# Altium project funny_car.PrjPCB
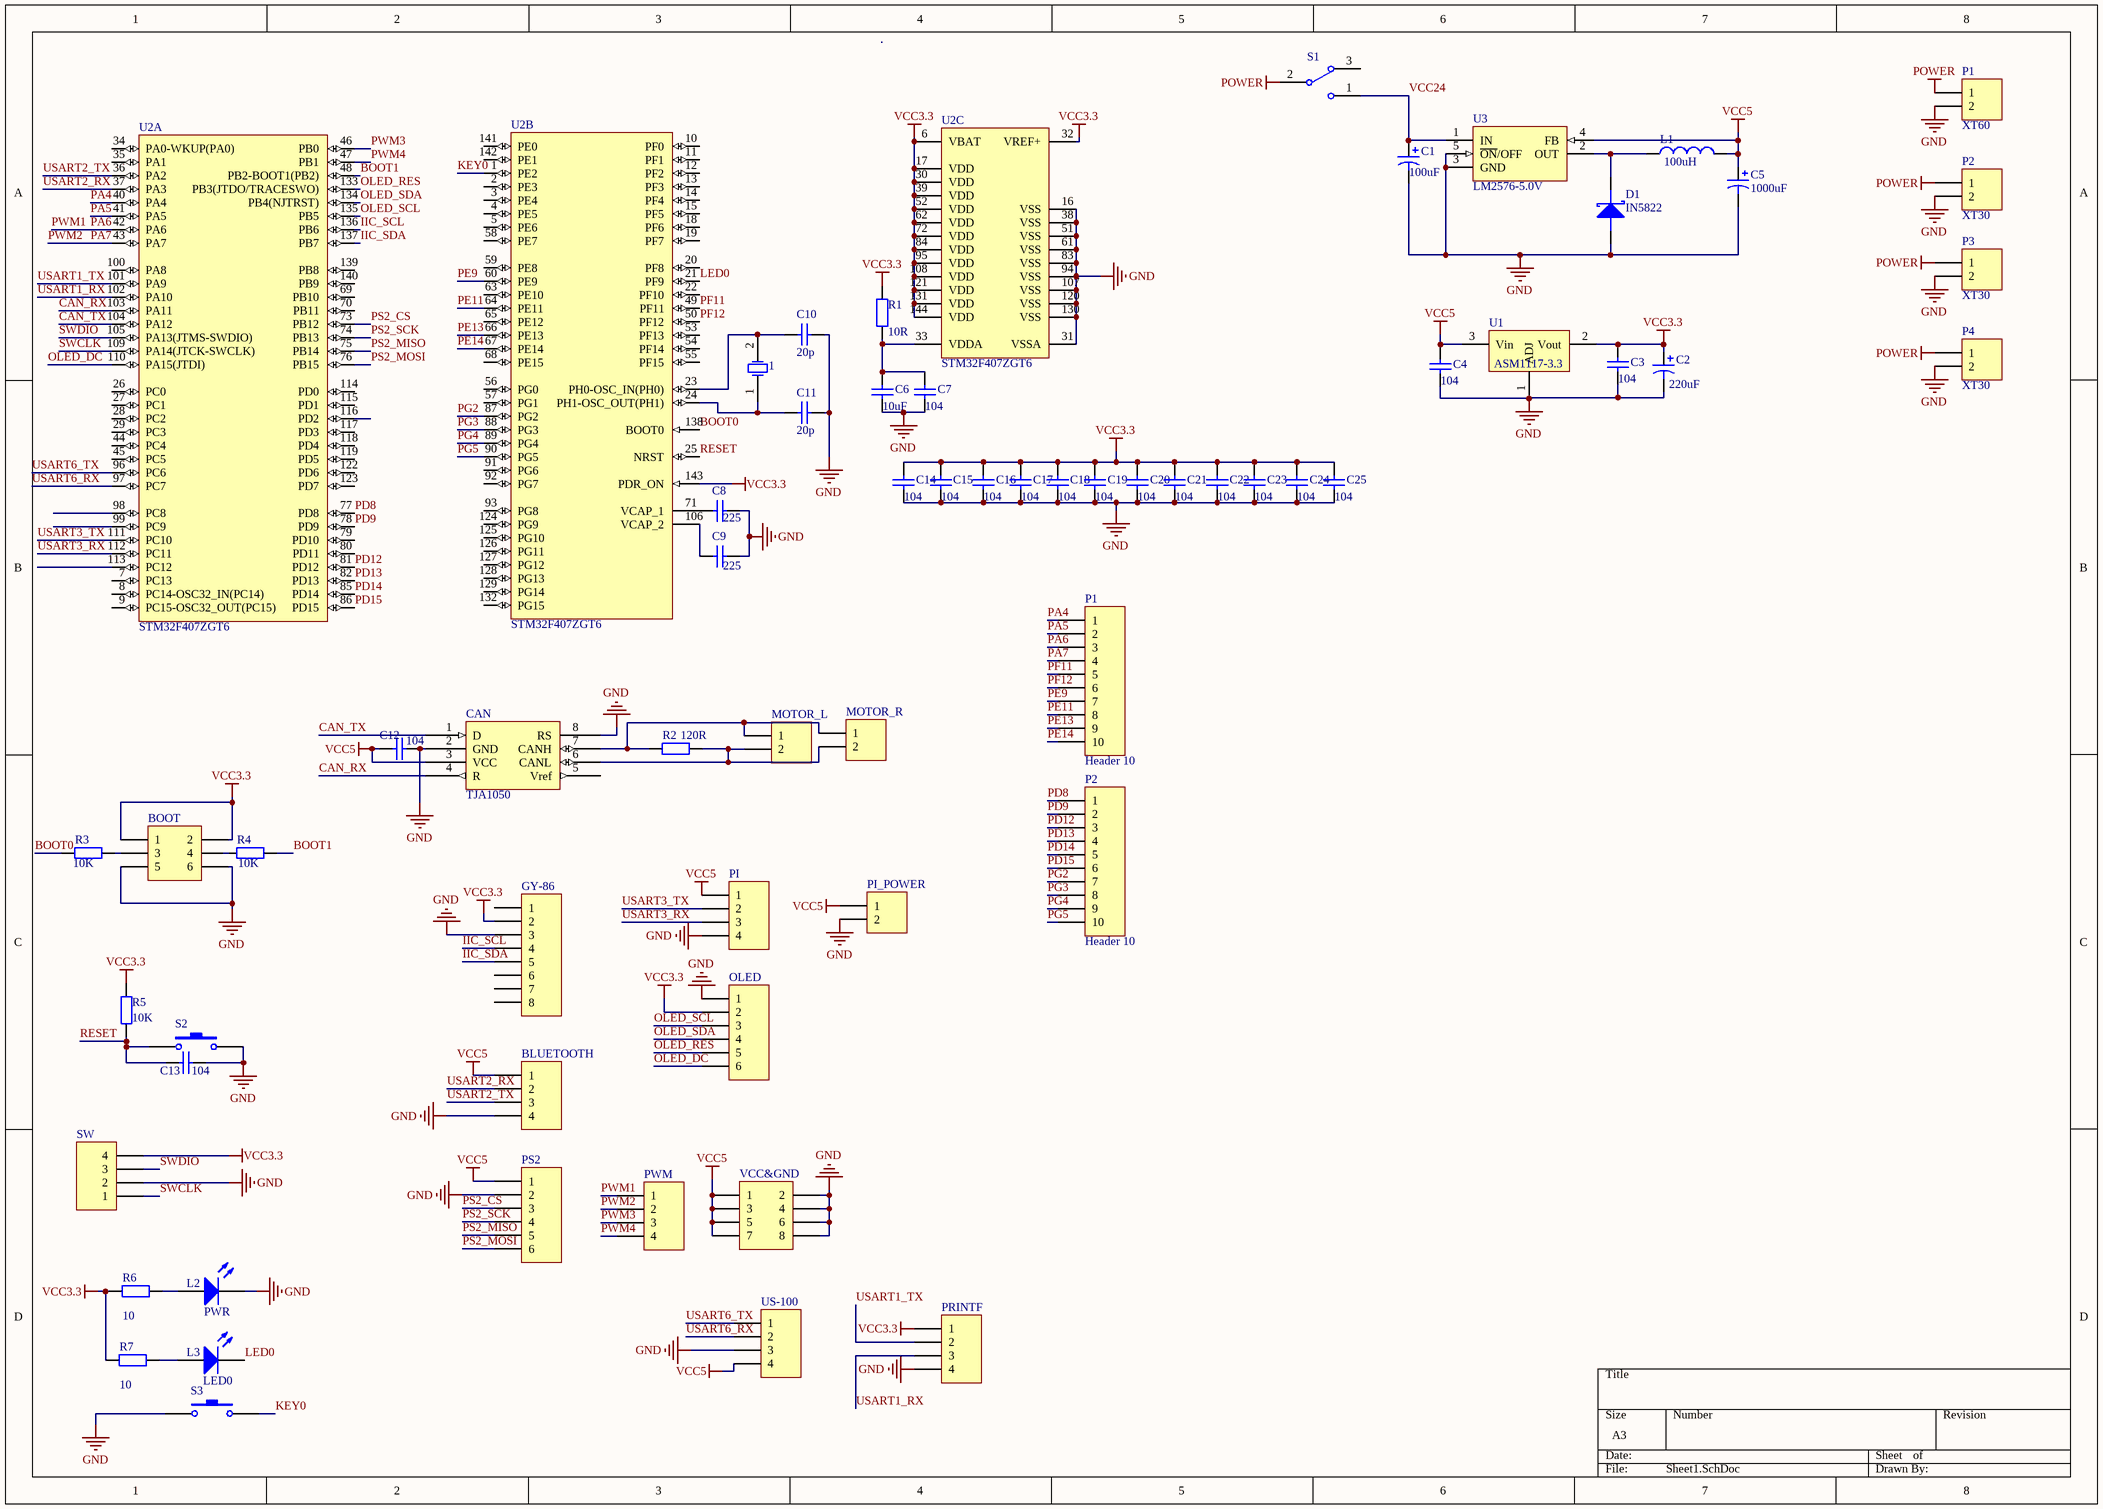
[diagram p0: Sheet1.SchDoc]
1 sheet, 64 parts. Net scope: global (net labels, ports and power ports of the same name join across sheets).
Board file: PCB1.PcbDoc

## Sheet Sheet1.SchDoc
size A3

### Parts
(Parts that share a designator on the sheet are numbered #1, #2 ... from top to bottom, then left to right.)
1  XTAL  [XTAL-QC49/SMD]  (value not drawn)
BLUETOOTH  Header 4  [ZH1.5-WS-4P]  (value not drawn)
BOOT  Header 3X2  [HDR2X3]  (value not drawn)
C1  value 100uF  [C7343]  (hidden comment: Cap Pol1)
C2  value 220uF  [C6032]
C3  value 104  [0805C]
C4  value 104  [0805C]
C5  value 1000uF  [SMD-EC-F10]  (hidden comment: Cap Pol1)
C6  value 10uF  [0805C]
C7  value 104  [0805C]
C8  value 225  [0805C]
C9  value 225  [0805C]
C10  value 20p  [0805C]  (hidden comment: Cap)
C11  value 20p  [0805C]  (hidden comment: Cap)
C12  value 104  [0805C]
C13  value 104  [0805C]
C14  value 104  [0805C]
C15  value 104  [0805C]
C16  value 104  [0805C]
C17  value 104  [0805C]
C18  value 104  [0805C]
C19  value 104  [0805C]
C20  value 104  [0805C]
C21  value 104  [0805C]
C22  value 104  [0805C]
C23  value 104  [0805C]
C24  value 104  [0805C]
C25  value 104  [0805C]
CAN  TJA1050  [SOP8_N]
D1  IN5822  [SMB]
GY-86  Header 8  [HDR1X8]  (value not drawn)
L1  value 100uH  [CD54NP]  (hidden comment: Inductor)
L2  PWR  [LED0805]
L3  LED0  [LED0805]
MOTOR_L  XH2.54*2  [ZH1.5-WS-2P]  (value not drawn)
MOTOR_R  XH2.54*2  [ZH1.5-WS-2P]  (value not drawn)
OLED  Header 6  [HDR1X6]  (value not drawn)
P1#1  XT60  [XT60PW]
P1#2  Header 10  [ZH1.5-WS-10P]
P2#1  XT30  [XT30PW]
P2#2  Header 10  [ZH1.5-WS-10P]
P3  XT30  [XT30PW]
P4  XT30  [2PIN-5.08B]
PI  Header 4  [ZH1.5-WS-4P]  (value not drawn)
PI_POWER  Header 2  [2PIN-5.08B]  (value not drawn)
PRINTF  Header 4  [ZH1.5-WS-4P]  (value not drawn)
PS2  Header 6  [ZH1.5-WS-6P]  (value not drawn)
PWM  Header 4  [HDR1X4]  (value not drawn)
R1  value 10R  [0805R]
R2  value 120R  [0805R]
R3  value 10K  [0805R]
R4  value 10K  [0805R]
R5  value 10K  [0805R]
R6  value 10  [0805R]
R7  value 10  [0805R]
S1  开关  [拨动开关]  (value not drawn)
S2  SW-PB  [TSW DIP-3*6*5]  (value not drawn)
S3  SW-PB  [TSW DIP-3*6*5]  (value not drawn)
SW  XH2.54*4  [ZH1.5-WS-4P]  (value not drawn)
U1  ASM1117-3.3  [SOT223]
U2  STM32F407ZGT6  [STM-LQFP144_N]  (parts A,B,C of 3)
U3  LM2576-5.0V  [TO263-5]
US-100  Header 4  [ZH1.5-WS-4P]  (value not drawn)
VCC&GND  Header 4X2  [HDR2X4]  (value not drawn)

### Nets
GND: BLUETOOTH.4 BOOT.5 BOOT.6 C1.2 C2.2 C3.1 C4.1 C5.2 C6.1 C7.1 C8.1 C9.2 C10.1 C11.1 C12.1 C13.1 C14.1 C15.1 C16.1 C17.1 C18.1 C19.1 C20.1 C21.1 C22.1 C23.1 C24.1 C25.1 CAN.2(GND) CAN.8(RS) D1.1 GY-86.3 L2.2(K) OLED.1 P1#1.2 P2#1.2 P3.2 P4.2 PI.4 PI_POWER.2 PRINTF.4 PS2.2 S2.2 S3.1 SW.2 U1.1(ADJ) U2.16(VSS) U2.31(VSSA) U2.38(VSS) U2.51(VSS) U2.61(VSS) U2.83(VSS) U2.94(VSS) U2.107(VSS) U2.120(VSS) U2.130(VSS) U3.3(GND) U3.5(~{ON}/OFF) US-100.3 VCC&GND.2 VCC&GND.4 VCC&GND.6 VCC&GND.8
POWER: P1#1.1 P2#1.1 P3.1 P4.1 S1.2
VCC3.3: BOOT.1 BOOT.2 C2.1 C3.2 C14.2 C15.2 C16.2 C17.2 C18.2 C19.2 C20.2 C21.2 C22.2 C23.2 C24.2 C25.2 GY-86.2 OLED.2 PRINTF.1 R1.1 R5.1 R6.1 R7.1 SW.4 U1.2(Vout) U2.6(VBAT) U2.17(VDD) U2.30(VDD) U2.32(VREF+) U2.39(VDD) U2.52(VDD) U2.62(VDD) U2.72(VDD) U2.84(VDD) U2.95(VDD) U2.108(VDD) U2.121(VDD) U2.131(VDD) U2.143(PDR_ON) U2.144(VDD)
VCC5: BLUETOOTH.1 C4.2 C5.1 C12.2 CAN.3(VCC) L1.2 PI.1 PI_POWER.1 PS2.1 U1.3(Vin) U3.4(FB) US-100.4 VCC&GND.1 VCC&GND.3 VCC&GND.5 VCC&GND.7
BOOT0: R3.1 U2.138(BOOT0)
BOOT1: R4.2 U2.48(PB2-BOOT1(PB2))
CAN_RX: CAN.4(R) U2.103(PA11)
CAN_TX: CAN.1(D) U2.104(PA12)
IIC_SCL: GY-86.4 U2.136(PB6)
IIC_SDA: GY-86.5 U2.137(PB7)
KEY0: S3.2 U2.1(PE2)
LED0: L3.2(K) U2.21(PF9)
OLED_DC: OLED.6 U2.110(PA15(JTDI))
OLED_RES: OLED.5 U2.133(PB3(JTDO/TRACESWO))
OLED_SCL: OLED.3 U2.135(PB5)
OLED_SDA: OLED.4 U2.134(PB4(NJTRST))
PA4: P1#2.1 U2.40(PA4)
PA5: P1#2.2 U2.41(PA5)
PA6: P1#2.3 PWM.1 U2.42(PA6)  [also labelled PWM1]
PA7: P1#2.4 PWM.2 U2.43(PA7)  [also labelled PWM2]
PD8: P2#2.1 U2.77(PD8)
PD9: P2#2.2 U2.78(PD9)
PD12: P2#2.3 U2.81(PD12)
PD13: P2#2.4 U2.82(PD13)
PD14: P2#2.5 U2.85(PD14)
PD15: P2#2.6 U2.86(PD15)
PE9: P1#2.7 U2.60(PE9)
PE11: P1#2.8 U2.64(PE11)
PE13: P1#2.9 U2.66(PE13)
PE14: P1#2.10 U2.67(PE14)
PF11: P1#2.5 U2.49(PF11)
PF12: P1#2.6 U2.50(PF12)
PG2: P2#2.7 U2.87(PG2)
PG3: P2#2.8 U2.88(PG3)
PG4: P2#2.9 U2.89(PG4)
PG5: P2#2.10 U2.90(PG5)
PS2_CS: PS2.3 U2.73(PB12)
PS2_MISO: PS2.5 U2.75(PB14)
PS2_MOSI: PS2.6 U2.76(PB15)
PS2_SCK: PS2.4 U2.74(PB13)
PWM3: PWM.3 U2.46(PB0)
PWM4: PWM.4 U2.47(PB1)
RESET: C13.2 R5.2 S2.1 U2.25(NRST)
SWCLK: SW.1 U2.109(PA14(JTCK-SWCLK))
SWDIO: SW.3 U2.105(PA13(JTMS-SWDIO))
USART1_RX: PRINTF.3 U2.102(PA10)
USART1_TX: PRINTF.2 U2.101(PA9)
USART2_RX: BLUETOOTH.2 U2.37(PA3)
USART2_TX: BLUETOOTH.3 U2.36(PA2)
USART3_RX: PI.3 U2.112(PC11)
USART3_TX: PI.2 U2.111(PC10)
USART6_RX: U2.97(PC7) US-100.2
USART6_TX: U2.96(PC6) US-100.1
VCC24: C1.1 S1.1 U3.1(IN)
Net1_1: 1.1(OSC1) C11.2 U2.24(PH1-OSC_OUT(PH1))
Net1_2: 1.2(OSC2) C10.2 U2.23(PH0-OSC_IN(PH0))
NetBOOT_3: BOOT.3 R3.2
NetBOOT_4: BOOT.4 R4.1
NetC6_2: C6.2 C7.2 R1.2 U2.33(VDDA)
NetC8_2: C8.2 U2.71(VCAP_1)
NetC9_1: C9.1 U2.106(VCAP_2)
NetCAN_6: CAN.6(CANL) MOTOR_L.2 MOTOR_R.2 R2.2
NetCAN_7: CAN.7(CANH) MOTOR_L.1 MOTOR_R.1 R2.1
NetD1_2: D1.2 L1.1 U3.2(OUT)
NetL2_1: L2.1(A) R6.2
NetL3_1: L3.1(A) R7.2

Not connected (* = marked no-connect by the designer): CAN 5(Vref); GY-86 1 6 7 8; S1 3; U2 2(PE3) 3(PE4) 4(PE5) 5(PE6) 7(PC13) 8(PC14-OSC32_IN(PC14)) 9(PC15-OSC32_OUT(PC15)) 10(PF0) 11(PF1) 12(PF2) 13(PF3) 14(PF4) 15(PF5) 18(PF6) 19(PF7) 20(PF8) 22(PF10) 26(PC0) 27(PC1) 28(PC2) 29(PC3) 34(PA0-WKUP(PA0)) 35(PA1) 44(PC4) 45(PC5) 53(PF13) 54(PF14) 55(PF15) 56(PG0) 57(PG1) 58(PE7) 59(PE8) 63(PE10) 65(PE12) 68(PE15) 69(PB10) 70(PB11) 79(PD10) 80(PD11) 91(PG6) 92(PG7) 93(PG8) 98(PC8) 99(PC9) 100(PA8) 113(PC12) 114(PD0) 115(PD1) 116(PD2) 117(PD3) 118(PD4) 119(PD5) 122(PD6) 123(PD7) 124(PG9) 125(PG10) 126(PG11) 127(PG12) 128(PG13) 129(PG14) 132(PG15) 139(PB8) 140(PB9) 141(PE0) 142(PE1)

### Library data of the parts
1 = XTAL: Crystal Oscillator; Published: 8-Jun-2000; LatestRevisionDate: 17-Jul-2002; LatestRevisionNote: Re-released for DXP Platform.; PackageReference: R38; Publisher: Altium Limited; PackageDescription: Crystal, Thru-Hole; 2 Leads; Body 3.1 x 8.2 mm (Dia.xH)
BLUETOOTH PI PRINTF PWM SW US-100 = Header 4: Header, 4-Pin; LatestRevisionDate: 17-Jul-2002; LatestRevisionNote: Re-released for DXP Platform.; Publisher: Altium Limited
BOOT = Header 3X2: Header, 3-Pin, Dual row; LatestRevisionDate: 17-Jul-2002; LatestRevisionNote: Re-released for DXP Platform.; Publisher: Altium Limited
C1 C2 C5 = Cap Pol1: Polarized Capacitor (Radial); Published: 8-Jun-2000; LatestRevisionDate: 17-Jul-2002; LatestRevisionNote: Re-released for DXP Platform.; PackageReference: RB7.6-15; Publisher: Altium Limited; PackageDescription: Polarized Capacitor (Radial); 2 Leads
C3 C4 C6-C25 = Cap: Capacitor; Published: 8-Jun-2000; LatestRevisionDate: 17-Jul-2002; LatestRevisionNote: Re-released for DXP Platform.; PackageReference: RAD-0.3; Publisher: Altium Limited; PackageDescription: Radial Cap, Thru-Hole; 2 Leads; 0.3 in Pin Spacing
CAN = 24CL256
D1 = DIODE-S
GY-86 = Header 8: Header, 8-Pin; LatestRevisionDate: 17-Jul-2002; LatestRevisionNote: Re-released for DXP Platform.; Publisher: Altium Limited
L1 = Inductor: Code_IEC: 1005; Published: 8-Jun-2000; LatestRevisionDate: 29-May-2009; LatestRevisionNote: IPC-7351 Footprint Added.; PackageReference: 0402-A; Publisher: Altium Limited; PackageDescription: Chip Inductor; Code_JEITA: 0402
L2 L3 = LED
MOTOR_L MOTOR_R P1#1 P2#1 P3 = Header 2: Header, 2-Pin; LatestRevisionDate: 17-Jul-2002; LatestRevisionNote: Re-released for DXP Platform.; Publisher: Altium Limited
OLED PS2 = Header 6: Header, 6-Pin; LatestRevisionDate: 17-Jul-2002; LatestRevisionNote: Re-released for DXP Platform.; Publisher: Altium Limited
P1#2 P2#2 = Header 10: Header, 10-Pin; LatestRevisionDate: 17-Jul-2002; LatestRevisionNote: Re-released for DXP Platform.; Publisher: Altium Limited
P4 PI_POWER = Header 2: Header, 2-Pin; pin to pad: 1>2 2>1; LatestRevisionDate: 17-Jul-2002; LatestRevisionNote: Re-released for DXP Platform.; Publisher: Altium Limited
R1-R7 = Res2: Resistor; Published: 8-Jun-2000; LatestRevisionDate: 17-Jul-2002; LatestRevisionNote: Re-released for DXP Platform.; PackageReference: AXIAL-0.4; Publisher: Altium Limited; PackageDescription: Axial Device, Thru-Hole; 2 Leads; 0.4 in Pin Spacing
S1 = 拨动开关（三脚）
S2 S3 = SW-PB: Switch; Published: 24-Mar-1999; LatestRevisionDate: 17-Jul-2002; LatestRevisionNote: Re-released for DXP Platform.; PackageReference: SPST-2; Publisher: Altium Limited; PackageDescription: Switch; 2 Leads
U1 = LM317: 3-Terminal Adjustable Positive Voltage Regulator
U2 = STM32F407ZGT6: ARM Cortex-M4 32-bit MCU+FPU, 210 DMIPS, 1024 kB Flash, 192 kB Internal RAM, 114 I/Os, 144-pin LQFP, -40 to 85 degC, Tray; Manufacturer: STMicroelectronics; D/A Converter: 2x12-bit; FLASH Size (Prog) (kB): 1024; I/Os (High Current): 114; Internal RAM Size (kB): 192; Operating Frequency(F) (Processor speed) (MHz): 168; Supply Voltage(Vcc) max (V): 3.6; Supply Voltage(Vcc) min (V): 1.8; DatasheetVersion: Rev. 4; PackageVersion: Rev. 4, 06/2013; PackageReference: LQFP144; PackageDescription: 144-Pin Low Profile Quad Flat Package, 20 x 20 mm Body, 0.5 mm Pitch; Supplier 1: Digi-Key; Supplier Part Number 1: 497-11766-ND; Supplier 2: Newark; Supplier Part Number 2: 73T2334; Supplier 3: Mouser; Supplier Part Number 3: 511-STM32F407ZGT6; Core: ARM Cortex-M4; Packing: Tray; Mounting Technology: Surface Mount; PartNumber: STM32F407ZGT6; ComponentLink1Description: Manufacturer URL; ComponentLink1URL: http://www.st.com/web/en/home.html; ComponentLink2Description: Datasheet; ComponentLink2URL: http://www.st.com/st-web-ui/static/active/en/resource/technical/document/datasheet/DM00037051.pdf; ComponentLink3Description: Package Specification; ComponentLink3URL: http://www.st.com/st-web-ui/static/active/en/resource/technical/document/datasheet/DM00037051.pdf
U3 = LM2576: DC降压芯片; 试用产品: 如您满意请支持正品; BOM名称: DC降压芯片; 学习资源: www.ooocke.com
VCC&GND = Header 4X2: Header, 4-Pin, Dual row; LatestRevisionDate: 17-Jul-2002; LatestRevisionNote: Re-released for DXP Platform.; Publisher: Altium Limited